# Altium schematic sheet Mikrolysreklamen15.SchDoc
size A3
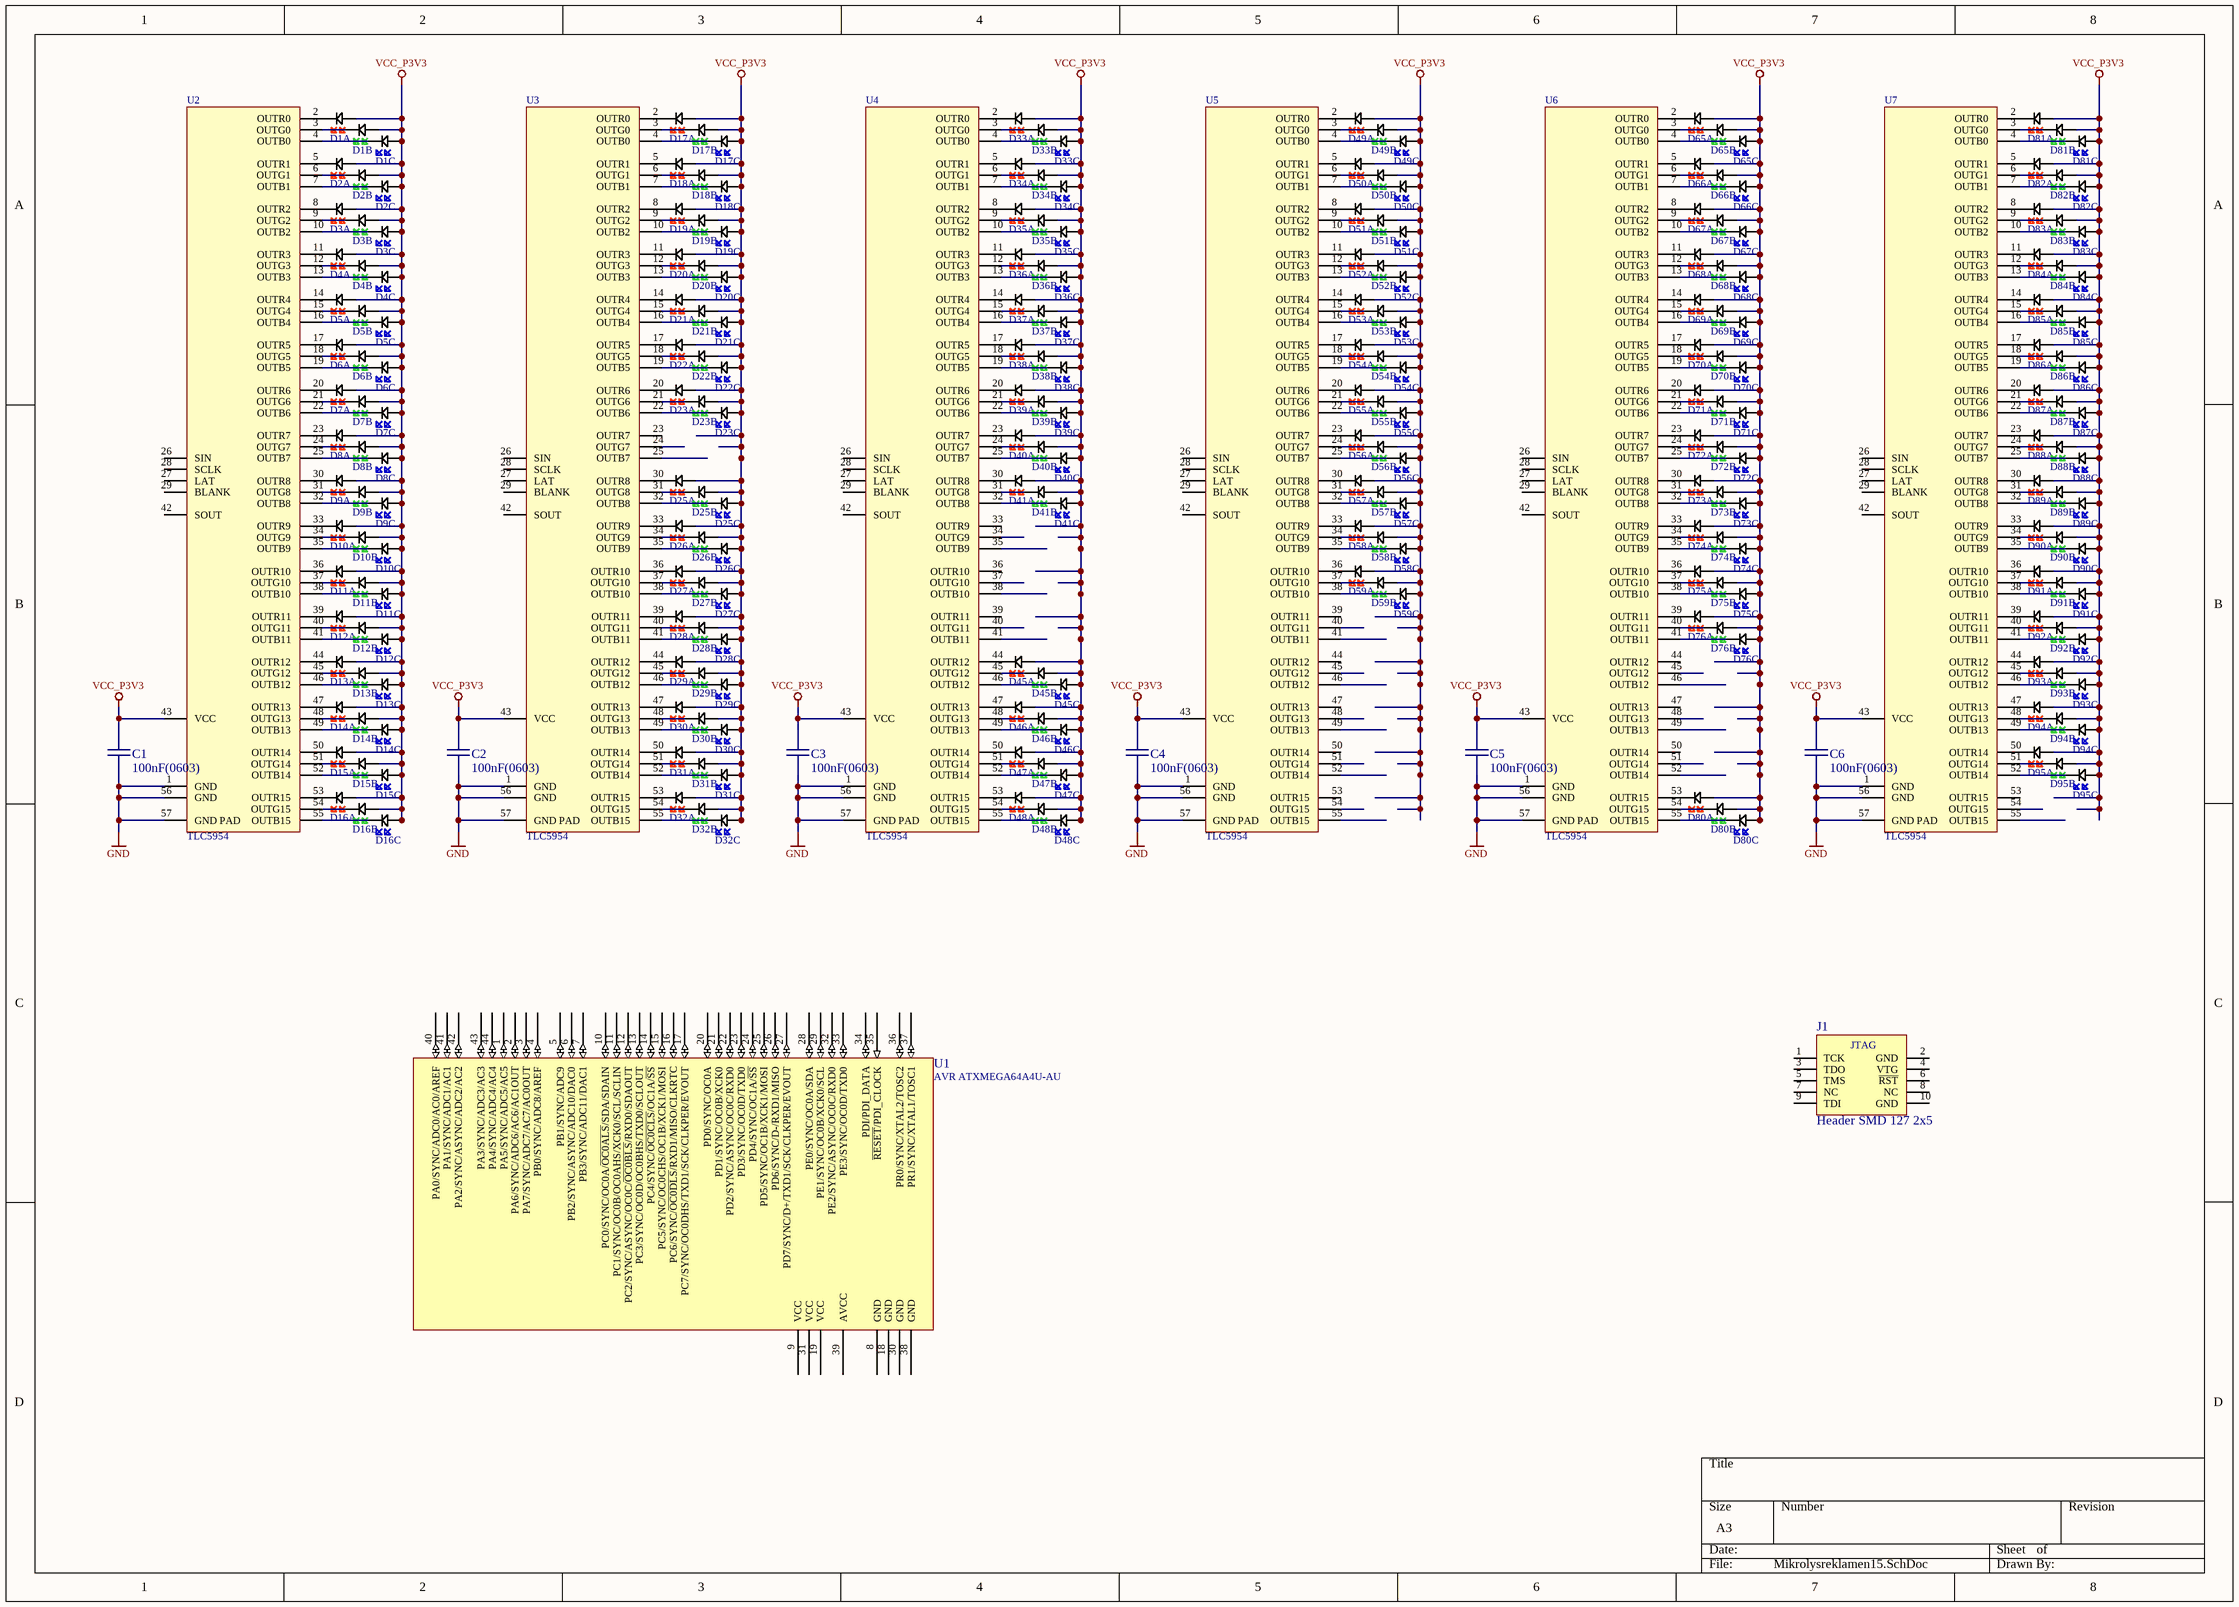
[diagram p0: Mikrolysreklamen15.SchDoc]

## Parts
C1  100nF(0603)  [CAPC0603(1608)55_N]
C2  100nF(0603)  [CAPC0603(1608)55_N]
C3  100nF(0603)  [CAPC0603(1608)55_N]
C4  100nF(0603)  [CAPC0603(1608)55_N]
C5  100nF(0603)  [CAPC0603(1608)55_N]
C6  100nF(0603)  [CAPC0603(1608)55_N]
D1  SX-0402-RGB SMD LED  [LED0402SX_N]  (value not drawn)  (parts A,B,C of 3)
D2  SX-0402-RGB SMD LED  [LED0402SX_N]  (value not drawn)  (parts A,B,C of 3)
D3  SX-0402-RGB SMD LED  [LED0402SX_N]  (value not drawn)  (parts A,B,C of 3)
D4  SX-0402-RGB SMD LED  [LED0402SX_N]  (value not drawn)  (parts A,B,C of 3)
D5  SX-0402-RGB SMD LED  [LED0402SX_N]  (value not drawn)  (parts A,B,C of 3)
D6  SX-0402-RGB SMD LED  [LED0402SX_N]  (value not drawn)  (parts A,B,C of 3)
D7  SX-0402-RGB SMD LED  [LED0402SX_N]  (value not drawn)  (parts A,B,C of 3)
D8  SX-0402-RGB SMD LED  [LED0402SX_N]  (value not drawn)  (parts A,B,C of 3)
D9  SX-0402-RGB SMD LED  [LED0402SX_N]  (value not drawn)  (parts A,B,C of 3)
D10  SX-0402-RGB SMD LED  [LED0402SX_N]  (value not drawn)  (parts A,B,C of 3)
D11  SX-0402-RGB SMD LED  [LED0402SX_N]  (value not drawn)  (parts A,B,C of 3)
D12  SX-0402-RGB SMD LED  [LED0402SX_N]  (value not drawn)  (parts A,B,C of 3)
D13  SX-0402-RGB SMD LED  [LED0402SX_N]  (value not drawn)  (parts A,B,C of 3)
D14  SX-0402-RGB SMD LED  [LED0402SX_N]  (value not drawn)  (parts A,B,C of 3)
D15  SX-0402-RGB SMD LED  [LED0402SX_N]  (value not drawn)  (parts A,B,C of 3)
D16  SX-0402-RGB SMD LED  [LED0402SX_N]  (value not drawn)  (parts A,B,C of 3)
D17  SX-0402-RGB SMD LED  [LED0402SX_N]  (value not drawn)  (parts A,B,C of 3)
D18  SX-0402-RGB SMD LED  [LED0402SX_N]  (value not drawn)  (parts A,B,C of 3)
D19  SX-0402-RGB SMD LED  [LED0402SX_N]  (value not drawn)  (parts A,B,C of 3)
D20  SX-0402-RGB SMD LED  [LED0402SX_N]  (value not drawn)  (parts A,B,C of 3)
D21  SX-0402-RGB SMD LED  [LED0402SX_N]  (value not drawn)  (parts A,B,C of 3)
D22  SX-0402-RGB SMD LED  [LED0402SX_N]  (value not drawn)  (parts A,B,C of 3)
D23  SX-0402-RGB SMD LED  [LED0402SX_N]  (value not drawn)  (parts A,B,C of 3)
D25  SX-0402-RGB SMD LED  [LED0402SX_N]  (value not drawn)  (parts A,B,C of 3)
D26  SX-0402-RGB SMD LED  [LED0402SX_N]  (value not drawn)  (parts A,B,C of 3)
D27  SX-0402-RGB SMD LED  [LED0402SX_N]  (value not drawn)  (parts A,B,C of 3)
D28  SX-0402-RGB SMD LED  [LED0402SX_N]  (value not drawn)  (parts A,B,C of 3)
D29  SX-0402-RGB SMD LED  [LED0402SX_N]  (value not drawn)  (parts A,B,C of 3)
D30  SX-0402-RGB SMD LED  [LED0402SX_N]  (value not drawn)  (parts A,B,C of 3)
D31  SX-0402-RGB SMD LED  [LED0402SX_N]  (value not drawn)  (parts A,B,C of 3)
D32  SX-0402-RGB SMD LED  [LED0402SX_N]  (value not drawn)  (parts A,B,C of 3)
D33  SX-0402-RGB SMD LED  [LED0402SX_N]  (value not drawn)  (parts A,B,C of 3)
D34  SX-0402-RGB SMD LED  [LED0402SX_N]  (value not drawn)  (parts A,B,C of 3)
D35  SX-0402-RGB SMD LED  [LED0402SX_N]  (value not drawn)  (parts A,B,C of 3)
D36  SX-0402-RGB SMD LED  [LED0402SX_N]  (value not drawn)  (parts A,B,C of 3)
D37  SX-0402-RGB SMD LED  [LED0402SX_N]  (value not drawn)  (parts A,B,C of 3)
D38  SX-0402-RGB SMD LED  [LED0402SX_N]  (value not drawn)  (parts A,B,C of 3)
D39  SX-0402-RGB SMD LED  [LED0402SX_N]  (value not drawn)  (parts A,B,C of 3)
D40  SX-0402-RGB SMD LED  [LED0402SX_N]  (value not drawn)  (parts A,B,C of 3)
D41  SX-0402-RGB SMD LED  [LED0402SX_N]  (value not drawn)  (parts A,B,C of 3)
D45  SX-0402-RGB SMD LED  [LED0402SX_N]  (value not drawn)  (parts A,B,C of 3)
D46  SX-0402-RGB SMD LED  [LED0402SX_N]  (value not drawn)  (parts A,B,C of 3)
D47  SX-0402-RGB SMD LED  [LED0402SX_N]  (value not drawn)  (parts A,B,C of 3)
D48  SX-0402-RGB SMD LED  [LED0402SX_N]  (value not drawn)  (parts A,B,C of 3)
D49  SX-0402-RGB SMD LED  [LED0402SX_N]  (value not drawn)  (parts A,B,C of 3)
D50  SX-0402-RGB SMD LED  [LED0402SX_N]  (value not drawn)  (parts A,B,C of 3)
D51  SX-0402-RGB SMD LED  [LED0402SX_N]  (value not drawn)  (parts A,B,C of 3)
D52  SX-0402-RGB SMD LED  [LED0402SX_N]  (value not drawn)  (parts A,B,C of 3)
D53  SX-0402-RGB SMD LED  [LED0402SX_N]  (value not drawn)  (parts A,B,C of 3)
D54  SX-0402-RGB SMD LED  [LED0402SX_N]  (value not drawn)  (parts A,B,C of 3)
D55  SX-0402-RGB SMD LED  [LED0402SX_N]  (value not drawn)  (parts A,B,C of 3)
D56  SX-0402-RGB SMD LED  [LED0402SX_N]  (value not drawn)  (parts A,B,C of 3)
D57  SX-0402-RGB SMD LED  [LED0402SX_N]  (value not drawn)  (parts A,B,C of 3)
D58  SX-0402-RGB SMD LED  [LED0402SX_N]  (value not drawn)  (parts A,B,C of 3)
D59  SX-0402-RGB SMD LED  [LED0402SX_N]  (value not drawn)  (parts A,B,C of 3)
D65  SX-0402-RGB SMD LED  [LED0402SX_N]  (value not drawn)  (parts A,B,C of 3)
D66  SX-0402-RGB SMD LED  [LED0402SX_N]  (value not drawn)  (parts A,B,C of 3)
D67  SX-0402-RGB SMD LED  [LED0402SX_N]  (value not drawn)  (parts A,B,C of 3)
D68  SX-0402-RGB SMD LED  [LED0402SX_N]  (value not drawn)  (parts A,B,C of 3)
D69  SX-0402-RGB SMD LED  [LED0402SX_N]  (value not drawn)  (parts A,B,C of 3)
D70  SX-0402-RGB SMD LED  [LED0402SX_N]  (value not drawn)  (parts A,B,C of 3)
D71  SX-0402-RGB SMD LED  [LED0402SX_N]  (value not drawn)  (parts A,B,C of 3)
D72  SX-0402-RGB SMD LED  [LED0402SX_N]  (value not drawn)  (parts A,B,C of 3)
D73  SX-0402-RGB SMD LED  [LED0402SX_N]  (value not drawn)  (parts A,B,C of 3)
D74  SX-0402-RGB SMD LED  [LED0402SX_N]  (value not drawn)  (parts A,B,C of 3)
D75  SX-0402-RGB SMD LED  [LED0402SX_N]  (value not drawn)  (parts A,B,C of 3)
D76  SX-0402-RGB SMD LED  [LED0402SX_N]  (value not drawn)  (parts A,B,C of 3)
D80  SX-0402-RGB SMD LED  [LED0402SX_N]  (value not drawn)  (parts A,B,C of 3)
D81  SX-0402-RGB SMD LED  [LED0402SX_N]  (value not drawn)  (parts A,B,C of 3)
D82  SX-0402-RGB SMD LED  [LED0402SX_N]  (value not drawn)  (parts A,B,C of 3)
D83  SX-0402-RGB SMD LED  [LED0402SX_N]  (value not drawn)  (parts A,B,C of 3)
D84  SX-0402-RGB SMD LED  [LED0402SX_N]  (value not drawn)  (parts A,B,C of 3)
D85  SX-0402-RGB SMD LED  [LED0402SX_N]  (value not drawn)  (parts A,B,C of 3)
D86  SX-0402-RGB SMD LED  [LED0402SX_N]  (value not drawn)  (parts A,B,C of 3)
D87  SX-0402-RGB SMD LED  [LED0402SX_N]  (value not drawn)  (parts A,B,C of 3)
D88  SX-0402-RGB SMD LED  [LED0402SX_N]  (value not drawn)  (parts A,B,C of 3)
D89  SX-0402-RGB SMD LED  [LED0402SX_N]  (value not drawn)  (parts A,B,C of 3)
D90  SX-0402-RGB SMD LED  [LED0402SX_N]  (value not drawn)  (parts A,B,C of 3)
D91  SX-0402-RGB SMD LED  [LED0402SX_N]  (value not drawn)  (parts A,B,C of 3)
D92  SX-0402-RGB SMD LED  [LED0402SX_N]  (value not drawn)  (parts A,B,C of 3)
D93  SX-0402-RGB SMD LED  [LED0402SX_N]  (value not drawn)  (parts A,B,C of 3)
D94  SX-0402-RGB SMD LED  [LED0402SX_N]  (value not drawn)  (parts A,B,C of 3)
D95  SX-0402-RGB SMD LED  [LED0402SX_N]  (value not drawn)  (parts A,B,C of 3)
J1  Header SMD 127 2x5  [SMDHDRV10P127_2X5_615X330X560B]
U1  AVR ATXMEGA64A4U-AU  [TQFP80P1200X1200X120-44N]
U2  TLC5954  [TQFN05P815X815X10-56_N]
U3  TLC5954  [TQFN05P815X815X10-56_N]
U4  TLC5954  [TQFN05P815X815X10-56_N]
U5  TLC5954  [TQFN05P815X815X10-56_N]
U6  TLC5954  [TQFN05P815X815X10-56_N]
U7  TLC5954  [TQFN05P815X815X10-56_N]

## Nets
GND: C1.1 C2.1 C3.1 C4.1 C5.1 C6.1 U2.1(GND) U2.56(GND) U2.57(GND_PAD) U3.1(GND) U3.56(GND) U3.57(GND_PAD) U4.1(GND) U4.56(GND) U4.57(GND_PAD) U5.1(GND) U5.56(GND) U5.57(GND_PAD) U6.1(GND) U6.56(GND) U6.57(GND_PAD) U7.1(GND) U7.56(GND) U7.57(GND_PAD)
VCC_P3V3: C1.2 C2.2 C3.2 C4.2 C5.2 C6.2 D1.1 D2.1 D3.1 D4.1 D5.1 D6.1 D7.1 D8.1 D9.1 D10.1 D11.1 D12.1 D13.1 D14.1 D15.1 D16.1 D17.1 D18.1 D19.1 D20.1 D21.1 D22.1 D23.1 D25.1 D26.1 D27.1 D28.1 D29.1 D30.1 D31.1 D32.1 D33.1 D34.1 D35.1 D36.1 D37.1 D38.1 D39.1 D40.1 D41.1 D45.1 D46.1 D47.1 D48.1 D49.1 D50.1 D51.1 D52.1 D53.1 D54.1 D55.1 D56.1 D57.1 D58.1 D59.1 D65.1 D66.1 D67.1 D68.1 D69.1 D70.1 D71.1 D72.1 D73.1 D74.1 D75.1 D76.1 D80.1 D81.1 D82.1 D83.1 D84.1 D85.1 D86.1 D87.1 D88.1 D89.1 D90.1 D91.1 D92.1 D93.1 D94.1 D95.1 U2.43(VCC) U3.43(VCC) U4.43(VCC) U5.43(VCC) U6.43(VCC) U7.43(VCC)
NetD1_2: D1.2 U2.2(OUTR0)
NetD1_3: D1.3 U2.3(OUTG0)
NetD1_4: D1.4 U2.4(OUTB0)
NetD2_2: D2.2 U2.5(OUTR1)
NetD2_3: D2.3 U2.6(OUTG1)
NetD2_4: D2.4 U2.7(OUTB1)
NetD3_2: D3.2 U2.8(OUTR2)
NetD3_3: D3.3 U2.9(OUTG2)
NetD3_4: D3.4 U2.10(OUTB2)
NetD4_2: D4.2 U2.11(OUTR3)
NetD4_3: D4.3 U2.12(OUTG3)
NetD4_4: D4.4 U2.13(OUTB3)
NetD5_2: D5.2 U2.14(OUTR4)
NetD5_3: D5.3 U2.15(OUTG4)
NetD5_4: D5.4 U2.16(OUTB4)
NetD6_2: D6.2 U2.17(OUTR5)
NetD6_3: D6.3 U2.18(OUTG5)
NetD6_4: D6.4 U2.19(OUTB5)
NetD7_2: D7.2 U2.20(OUTR6)
NetD7_3: D7.3 U2.21(OUTG6)
NetD7_4: D7.4 U2.22(OUTB6)
NetD8_2: D8.2 U2.23(OUTR7)
NetD8_3: D8.3 U2.24(OUTG7)
NetD8_4: D8.4 U2.25(OUTB7)
NetD9_2: D9.2 U2.30(OUTR8)
NetD9_3: D9.3 U2.31(OUTG8)
NetD9_4: D9.4 U2.32(OUTB8)
NetD10_2: D10.2 U2.33(OUTR9)
NetD10_3: D10.3 U2.34(OUTG9)
NetD10_4: D10.4 U2.35(OUTB9)
NetD11_2: D11.2 U2.36(OUTR10)
NetD11_3: D11.3 U2.37(OUTG10)
NetD11_4: D11.4 U2.38(OUTB10)
NetD12_2: D12.2 U2.39(OUTR11)
NetD12_3: D12.3 U2.40(OUTG11)
NetD12_4: D12.4 U2.41(OUTB11)
NetD13_2: D13.2 U2.44(OUTR12)
NetD13_3: D13.3 U2.45(OUTG12)
NetD13_4: D13.4 U2.46(OUTB12)
NetD14_2: D14.2 U2.47(OUTR13)
NetD14_3: D14.3 U2.48(OUTG13)
NetD14_4: D14.4 U2.49(OUTB13)
NetD15_2: D15.2 U2.50(OUTR14)
NetD15_3: D15.3 U2.51(OUTG14)
NetD15_4: D15.4 U2.52(OUTB14)
NetD16_2: D16.2 U2.53(OUTR15)
NetD16_3: D16.3 U2.54(OUTG15)
NetD16_4: D16.4 U2.55(OUTB15)
NetD17_2: D17.2 U3.2(OUTR0)
NetD17_3: D17.3 U3.3(OUTG0)
NetD17_4: D17.4 U3.4(OUTB0)
NetD18_2: D18.2 U3.5(OUTR1)
NetD18_3: D18.3 U3.6(OUTG1)
NetD18_4: D18.4 U3.7(OUTB1)
NetD19_2: D19.2 U3.8(OUTR2)
NetD19_3: D19.3 U3.9(OUTG2)
NetD19_4: D19.4 U3.10(OUTB2)
NetD20_2: D20.2 U3.11(OUTR3)
NetD20_3: D20.3 U3.12(OUTG3)
NetD20_4: D20.4 U3.13(OUTB3)
NetD21_2: D21.2 U3.14(OUTR4)
NetD21_3: D21.3 U3.15(OUTG4)
NetD21_4: D21.4 U3.16(OUTB4)
NetD22_2: D22.2 U3.17(OUTR5)
NetD22_3: D22.3 U3.18(OUTG5)
NetD22_4: D22.4 U3.19(OUTB5)
NetD23_2: D23.2 U3.20(OUTR6)
NetD23_3: D23.3 U3.21(OUTG6)
NetD23_4: D23.4 U3.22(OUTB6)
NetD25_2: D25.2 U3.30(OUTR8)
NetD25_3: D25.3 U3.31(OUTG8)
NetD25_4: D25.4 U3.32(OUTB8)
NetD26_2: D26.2 U3.33(OUTR9)
NetD26_3: D26.3 U3.34(OUTG9)
NetD26_4: D26.4 U3.35(OUTB9)
NetD27_2: D27.2 U3.36(OUTR10)
NetD27_3: D27.3 U3.37(OUTG10)
NetD27_4: D27.4 U3.38(OUTB10)
NetD28_2: D28.2 U3.39(OUTR11)
NetD28_3: D28.3 U3.40(OUTG11)
NetD28_4: D28.4 U3.41(OUTB11)
NetD29_2: D29.2 U3.44(OUTR12)
NetD29_3: D29.3 U3.45(OUTG12)
NetD29_4: D29.4 U3.46(OUTB12)
NetD30_2: D30.2 U3.47(OUTR13)
NetD30_3: D30.3 U3.48(OUTG13)
NetD30_4: D30.4 U3.49(OUTB13)
NetD31_2: D31.2 U3.50(OUTR14)
NetD31_3: D31.3 U3.51(OUTG14)
NetD31_4: D31.4 U3.52(OUTB14)
NetD32_2: D32.2 U3.53(OUTR15)
NetD32_3: D32.3 U3.54(OUTG15)
NetD32_4: D32.4 U3.55(OUTB15)
NetD33_2: D33.2 U4.2(OUTR0)
NetD33_3: D33.3 U4.3(OUTG0)
NetD33_4: D33.4 U4.4(OUTB0)
NetD34_2: D34.2 U4.5(OUTR1)
NetD34_3: D34.3 U4.6(OUTG1)
NetD34_4: D34.4 U4.7(OUTB1)
NetD35_2: D35.2 U4.8(OUTR2)
NetD35_3: D35.3 U4.9(OUTG2)
NetD35_4: D35.4 U4.10(OUTB2)
NetD36_2: D36.2 U4.11(OUTR3)
NetD36_3: D36.3 U4.12(OUTG3)
NetD36_4: D36.4 U4.13(OUTB3)
NetD37_2: D37.2 U4.14(OUTR4)
NetD37_3: D37.3 U4.15(OUTG4)
NetD37_4: D37.4 U4.16(OUTB4)
NetD38_2: D38.2 U4.17(OUTR5)
NetD38_3: D38.3 U4.18(OUTG5)
NetD38_4: D38.4 U4.19(OUTB5)
NetD39_2: D39.2 U4.20(OUTR6)
NetD39_3: D39.3 U4.21(OUTG6)
NetD39_4: D39.4 U4.22(OUTB6)
NetD40_2: D40.2 U4.23(OUTR7)
NetD40_3: D40.3 U4.24(OUTG7)
NetD40_4: D40.4 U4.25(OUTB7)
NetD41_2: D41.2 U4.30(OUTR8)
NetD41_3: D41.3 U4.31(OUTG8)
NetD41_4: D41.4 U4.32(OUTB8)
NetD45_2: D45.2 U4.44(OUTR12)
NetD45_3: D45.3 U4.45(OUTG12)
NetD45_4: D45.4 U4.46(OUTB12)
NetD46_2: D46.2 U4.47(OUTR13)
NetD46_3: D46.3 U4.48(OUTG13)
NetD46_4: D46.4 U4.49(OUTB13)
NetD47_2: D47.2 U4.50(OUTR14)
NetD47_3: D47.3 U4.51(OUTG14)
NetD47_4: D47.4 U4.52(OUTB14)
NetD48_2: D48.2 U4.53(OUTR15)
NetD48_3: D48.3 U4.54(OUTG15)
NetD48_4: D48.4 U4.55(OUTB15)
NetD49_2: D49.2 U5.2(OUTR0)
NetD49_3: D49.3 U5.3(OUTG0)
NetD49_4: D49.4 U5.4(OUTB0)
NetD50_2: D50.2 U5.5(OUTR1)
NetD50_3: D50.3 U5.6(OUTG1)
NetD50_4: D50.4 U5.7(OUTB1)
NetD51_2: D51.2 U5.8(OUTR2)
NetD51_3: D51.3 U5.9(OUTG2)
NetD51_4: D51.4 U5.10(OUTB2)
NetD52_2: D52.2 U5.11(OUTR3)
NetD52_3: D52.3 U5.12(OUTG3)
NetD52_4: D52.4 U5.13(OUTB3)
NetD53_2: D53.2 U5.14(OUTR4)
NetD53_3: D53.3 U5.15(OUTG4)
NetD53_4: D53.4 U5.16(OUTB4)
NetD54_2: D54.2 U5.17(OUTR5)
NetD54_3: D54.3 U5.18(OUTG5)
NetD54_4: D54.4 U5.19(OUTB5)
NetD55_2: D55.2 U5.20(OUTR6)
NetD55_3: D55.3 U5.21(OUTG6)
NetD55_4: D55.4 U5.22(OUTB6)
NetD56_2: D56.2 U5.23(OUTR7)
NetD56_3: D56.3 U5.24(OUTG7)
NetD56_4: D56.4 U5.25(OUTB7)
NetD57_2: D57.2 U5.30(OUTR8)
NetD57_3: D57.3 U5.31(OUTG8)
NetD57_4: D57.4 U5.32(OUTB8)
NetD58_2: D58.2 U5.33(OUTR9)
NetD58_3: D58.3 U5.34(OUTG9)
NetD58_4: D58.4 U5.35(OUTB9)
NetD59_2: D59.2 U5.36(OUTR10)
NetD59_3: D59.3 U5.37(OUTG10)
NetD59_4: D59.4 U5.38(OUTB10)
NetD65_2: D65.2 U6.2(OUTR0)
NetD65_3: D65.3 U6.3(OUTG0)
NetD65_4: D65.4 U6.4(OUTB0)
NetD66_2: D66.2 U6.5(OUTR1)
NetD66_3: D66.3 U6.6(OUTG1)
NetD66_4: D66.4 U6.7(OUTB1)
NetD67_2: D67.2 U6.8(OUTR2)
NetD67_3: D67.3 U6.9(OUTG2)
NetD67_4: D67.4 U6.10(OUTB2)
NetD68_2: D68.2 U6.11(OUTR3)
NetD68_3: D68.3 U6.12(OUTG3)
NetD68_4: D68.4 U6.13(OUTB3)
NetD69_2: D69.2 U6.14(OUTR4)
NetD69_3: D69.3 U6.15(OUTG4)
NetD69_4: D69.4 U6.16(OUTB4)
NetD70_2: D70.2 U6.17(OUTR5)
NetD70_3: D70.3 U6.18(OUTG5)
NetD70_4: D70.4 U6.19(OUTB5)
NetD71_2: D71.2 U6.20(OUTR6)
NetD71_3: D71.3 U6.21(OUTG6)
NetD71_4: D71.4 U6.22(OUTB6)
NetD72_2: D72.2 U6.23(OUTR7)
NetD72_3: D72.3 U6.24(OUTG7)
NetD72_4: D72.4 U6.25(OUTB7)
NetD73_2: D73.2 U6.30(OUTR8)
NetD73_3: D73.3 U6.31(OUTG8)
NetD73_4: D73.4 U6.32(OUTB8)
NetD74_2: D74.2 U6.33(OUTR9)
NetD74_3: D74.3 U6.34(OUTG9)
NetD74_4: D74.4 U6.35(OUTB9)
NetD75_2: D75.2 U6.36(OUTR10)
NetD75_3: D75.3 U6.37(OUTG10)
NetD75_4: D75.4 U6.38(OUTB10)
NetD76_2: D76.2 U6.39(OUTR11)
NetD76_3: D76.3 U6.40(OUTG11)
NetD76_4: D76.4 U6.41(OUTB11)
NetD80_2: D80.2 U6.53(OUTR15)
NetD80_3: D80.3 U6.54(OUTG15)
NetD80_4: D80.4 U6.55(OUTB15)
NetD81_2: D81.2 U7.2(OUTR0)
NetD81_3: D81.3 U7.3(OUTG0)
NetD81_4: D81.4 U7.4(OUTB0)
NetD82_2: D82.2 U7.5(OUTR1)
NetD82_3: D82.3 U7.6(OUTG1)
NetD82_4: D82.4 U7.7(OUTB1)
NetD83_2: D83.2 U7.8(OUTR2)
NetD83_3: D83.3 U7.9(OUTG2)
NetD83_4: D83.4 U7.10(OUTB2)
NetD84_2: D84.2 U7.11(OUTR3)
NetD84_3: D84.3 U7.12(OUTG3)
NetD84_4: D84.4 U7.13(OUTB3)
NetD85_2: D85.2 U7.14(OUTR4)
NetD85_3: D85.3 U7.15(OUTG4)
NetD85_4: D85.4 U7.16(OUTB4)
NetD86_2: D86.2 U7.17(OUTR5)
NetD86_3: D86.3 U7.18(OUTG5)
NetD86_4: D86.4 U7.19(OUTB5)
NetD87_2: D87.2 U7.20(OUTR6)
NetD87_3: D87.3 U7.21(OUTG6)
NetD87_4: D87.4 U7.22(OUTB6)
NetD88_2: D88.2 U7.23(OUTR7)
NetD88_3: D88.3 U7.24(OUTG7)
NetD88_4: D88.4 U7.25(OUTB7)
NetD89_2: D89.2 U7.30(OUTR8)
NetD89_3: D89.3 U7.31(OUTG8)
NetD89_4: D89.4 U7.32(OUTB8)
NetD90_2: D90.2 U7.33(OUTR9)
NetD90_3: D90.3 U7.34(OUTG9)
NetD90_4: D90.4 U7.35(OUTB9)
NetD91_2: D91.2 U7.36(OUTR10)
NetD91_3: D91.3 U7.37(OUTG10)
NetD91_4: D91.4 U7.38(OUTB10)
NetD92_2: D92.2 U7.39(OUTR11)
NetD92_3: D92.3 U7.40(OUTG11)
NetD92_4: D92.4 U7.41(OUTB11)
NetD93_2: D93.2 U7.44(OUTR12)
NetD93_3: D93.3 U7.45(OUTG12)
NetD93_4: D93.4 U7.46(OUTB12)
NetD94_2: D94.2 U7.47(OUTR13)
NetD94_3: D94.3 U7.48(OUTG13)
NetD94_4: D94.4 U7.49(OUTB13)
NetD95_2: D95.2 U7.50(OUTR14)
NetD95_3: D95.3 U7.51(OUTG14)
NetD95_4: D95.4 U7.52(OUTB14)

Not connected (* = marked no-connect by the designer): J1 1(TCK) 2(GND) 3(TDO) 4(VTG) 5(TMS) 6(~{RST}) 7(NC) 8(NC) 9(TDI) 10(GND); U1 1(PA5/SYNC/ADC5/AC5) 2(PA6/SYNC/ADC6/AC6/AC1OUT) 3(PA7/SYNC/ADC7/AC7/AC0OUT) 4(PB0/SYNC/ADC8/AREF) 5(PB1/SYNC/ADC9) 6(PB2/SYNC/ASYNC/ADC10/DAC0) 7(PB3/SYNC/ADC11/DAC1) 8(GND) 9(VCC) 10(PC0/SYNC/OC0A/~{OC0ALS}/SDA/SDAIN) 11(PC1/SYNC/OC0B/OC0AHS/XCK0/SCL/SCLIN) 12(PC2/SYNC/ASYNC/OC0C/~{OC0BLS}/RXD0/SDAOUT) 13(PC3/SYNC/OC0D/OC0BHS/TXD0/SCLOUT) 14(PC4/SYNC/~{OC0CLS}/OC1A/~{SS}) 15(PC5/SYNC/OC0CHS/OC1B/XCK1/MOSI) 16(PC6/SYNC/~{OC0DLS}/RXD1/MISO/CLKRTC) 17(PC7/SYNC/OC0DHS/TXD1/SCK/CLKPER/EVOUT) 18(GND) 19(VCC) 20(PD0/SYNC/OC0A) 21(PD1/SYNC/OC0B/XCK0) 22(PD2/SYNC/ASYNC/OC0C/RXD0) 23(PD3/SYNC/OC0D/TXD0) 24(PD4/SYNC/OC1A/~{SS}) 25(PD5/SYNC/OC1B/XCK1/MOSI) 26(PD6/SYNC/D-/RXD1/MISO) 27(PD7/SYNC/D+/TXD1/SCK/CLKPER/EVOUT) 28(PE0/SYNC/OC0A/SDA) 29(PE1/SYNC/OC0B/XCK0/SCL) 30(GND) 31(VCC) 32(PE2/SYNC/ASYNC/OC0C/RXD0) 33(PE3/SYNC/OC0D/TXD0) 34(PDI/PDI_DATA) 35(~{RESET}/PDI_CLOCK) 36(PR0/SYNC/XTAL2/TOSC2) 37(PR1/SYNC/XTAL1/TOSC1) 38(GND) 39(AVCC) 40(PA0/SYNC/ADC0/AC0/AREF) 41(PA1/SYNC/ADC1/AC1) 42(PA2/SYNC/ASYNC/ADC2/AC2) 43(PA3/SYNC/ADC3/AC3) 44(PA4/SYNC/ADC4/AC4); U2 26(SIN) 27(LAT) 28(SCLK) 29(BLANK) 42(SOUT); U3 23(OUTR7) 24(OUTG7) 25(OUTB7) 26(SIN) 27(LAT) 28(SCLK) 29(BLANK) 42(SOUT); U4 26(SIN) 27(LAT) 28(SCLK) 29(BLANK) 33(OUTR9) 34(OUTG9) 35(OUTB9) 36(OUTR10) 37(OUTG10) 38(OUTB10) 39(OUTR11) 40(OUTG11) 41(OUTB11) 42(SOUT); U5 26(SIN) 27(LAT) 28(SCLK) 29(BLANK) 39(OUTR11) 40(OUTG11) 41(OUTB11) 42(SOUT) 44(OUTR12) 45(OUTG12) 46(OUTB12) 47(OUTR13) 48(OUTG13) 49(OUTB13) 50(OUTR14) 51(OUTG14) 52(OUTB14) 53(OUTR15) 54(OUTG15) 55(OUTB15); U6 26(SIN) 27(LAT) 28(SCLK) 29(BLANK) 42(SOUT) 44(OUTR12) 45(OUTG12) 46(OUTB12) 47(OUTR13) 48(OUTG13) 49(OUTB13) 50(OUTR14) 51(OUTG14) 52(OUTB14); U7 26(SIN) 27(LAT) 28(SCLK) 29(BLANK) 42(SOUT) 53(OUTR15) 54(OUTG15) 55(OUTB15)

## Library data of the parts
C1-C6 = 3028: 100nF 0603 5% X7R 50V; pakke_opprettet_av: 815; leverandor_varenr: 1759122; pris: 1; nokkelord: Kondensator, Capacitor, CAP; pakketype: 93; produsent: Multikomp; leverandor: Farnell; id: 3028; navn: 100nF(0603); pakke_opprettet: 18.02.2015 14:18:13; symbol_opprettet_av: 815; symbol_opprettet: 14.11.2014 20:19:34
D1-D23 D25-D41 D45-D59 D65-D76 D80-D95 = 3254: 1010 (metric) SMD RGB LED; rad: 4; rom: OV; lager_type: Fremlager; dybde: 0; hylle: 2; antall: 40; pakke_opprettet_av: 815; pris: 1; nokkelord: LED, RGB, Lysdiode; pakketype: 96; produsent: SONGXIN LIGHT; id: 3254; navn: SX-0402-RGB SMD LED; kolonne: 4; pakke_opprettet: 15.10.2015 22:30:58; symbol_opprettet_av: 815; symbol_opprettet: 15.10.2015 22:41:28
J1 = 2449: 1,27mm Pitch SMD Header; id: 2449; pakke_opprettet_av: 815; pris: 20; nokkelord: JTAG; pakketype: 101; pakke_opprettet: 15.11.2014 18:30:38; symbol_opprettet_av: 815; symbol_opprettet: 15.11.2014 18:33:29; navn: Header SMD 127 2x5
U1 = 2103: Mikrokontroller; id: 2103; rad: 4; rom: OV; lager_type: Fremlager; dybde: 0; antall: 75; kolonne: 2; pakke_opprettet_av: 774; pakketype: 45; produsent: Atmel; hylle: 0; pakke_opprettet: 22.08.2014 14:00:28; symbol_opprettet_av: 774; symbol_opprettet: 22.08.2014 14:00:55; navn: AVR ATXMEGA64A4U-AU; pris: 0
U2-U7 = 3253: 48ch LED Driver with Global Brightness Control, LED Open/Short Detection and Power-Save Mode; rad: 4; rom: OV; lager_type: Fremlager; dybde: 0; hylle: 2; antall: 40; pakke_opprettet_av: 815; pris: 60; nokkelord: LED, CTRL, controller, kontroller, constant current; pakketype: 46; produsent: Texas Instruments; id: 3253; leverandor_varenr: 296-40587-1-ND; leverandor: DigiKey; navn: TLC5954; kolonne: 4; pakke_opprettet: 15.10.2015 20:40:26; symbol_opprettet_av: 815; symbol_opprettet: 15.10.2015 20:41:10